# Altium schematic sheet Monitoring.SchDoc
size Letter; SheetNumber: 9; SheetTotal: 13
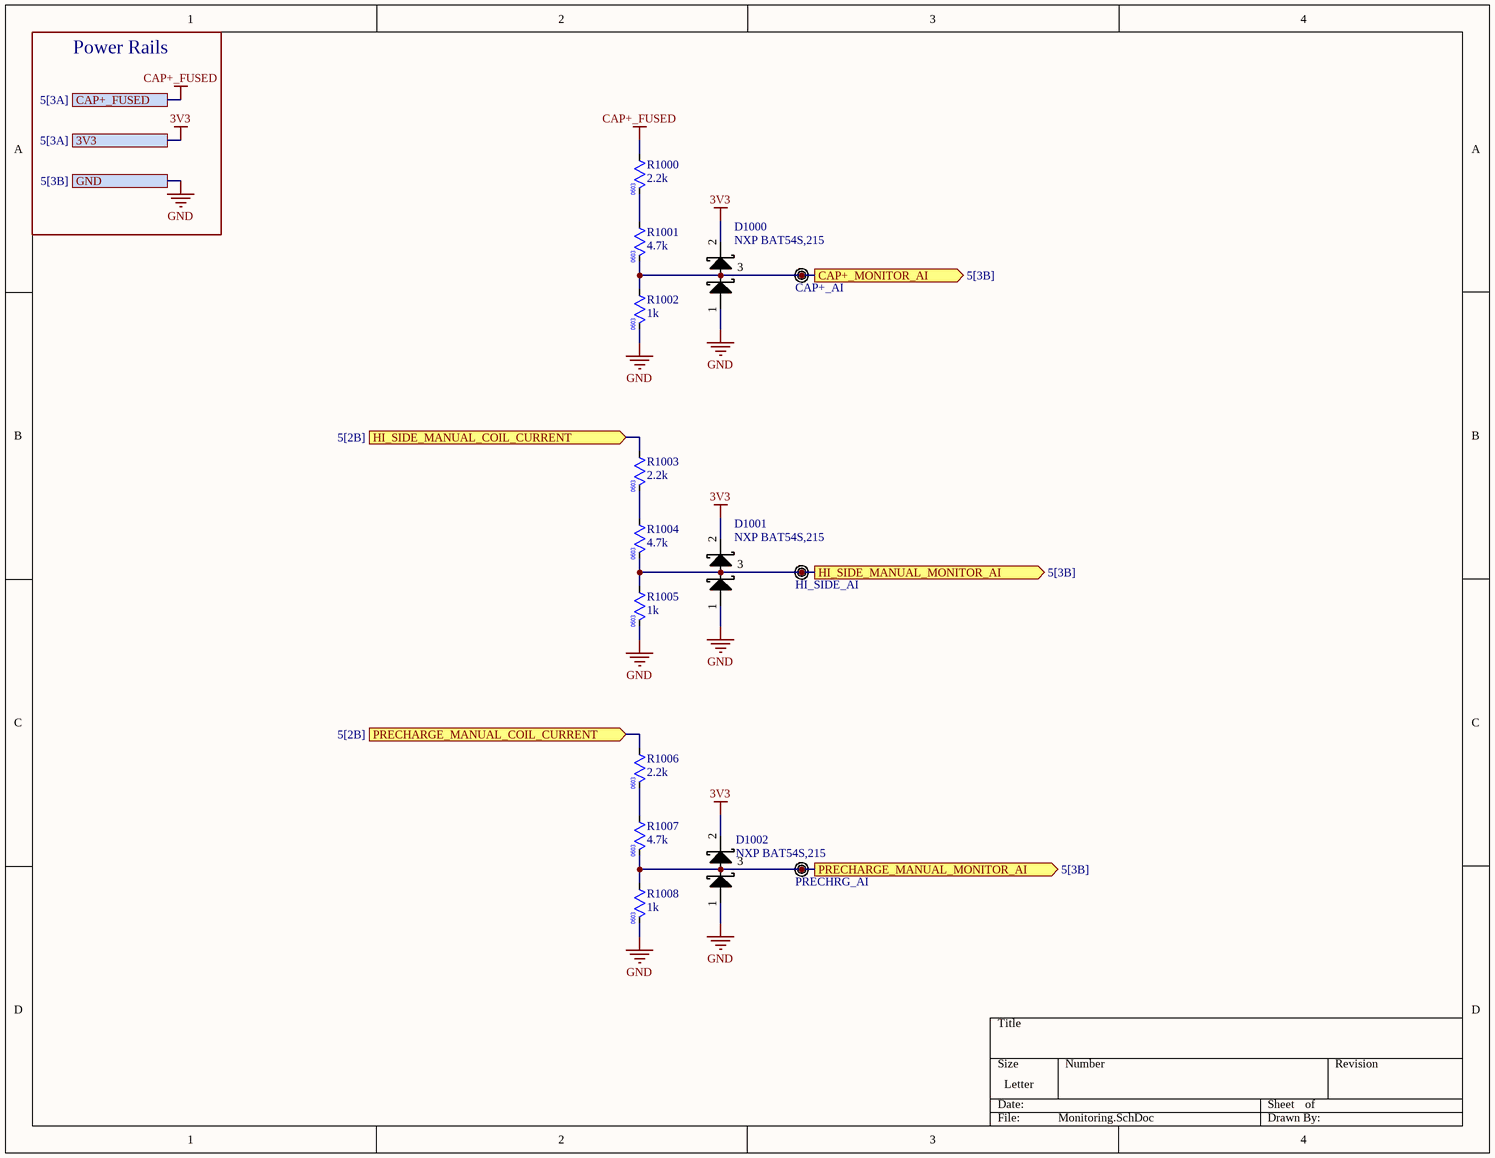
[diagram p0: Monitoring.SchDoc]

## Parts
D1000  NXP BAT54S,215  [NXP BAT54S,215]
D1001  NXP BAT54S,215  [NXP BAT54S,215]
D1002  NXP BAT54S,215  [NXP BAT54S,215]
R1000  value 2.2k  [0603 Resistor Footprint]  (hidden comment: 0603 2k2 1% 0.25W)
R1001  value 4.7k  [0603 Resistor Footprint]  (hidden comment: 0603 4k7 1% 0.33W)
R1002  value 1k  [0603 Resistor Footprint]  (hidden comment: 0603 1k 1% 0.33W)
R1003  value 2.2k  [0603 Resistor Footprint]  (hidden comment: 0603 2k2 1% 0.25W)
R1004  value 4.7k  [0603 Resistor Footprint]  (hidden comment: 0603 4k7 1% 0.33W)
R1005  value 1k  [0603 Resistor Footprint]  (hidden comment: 0603 1k 1% 0.33W)
R1006  value 2.2k  [0603 Resistor Footprint]  (hidden comment: 0603 2k2 1% 0.25W)
R1007  value 4.7k  [0603 Resistor Footprint]  (hidden comment: 0603 4k7 1% 0.33W)
R1008  value 1k  [0603 Resistor Footprint]  (hidden comment: 0603 1k 1% 0.33W)
TP1000  CAP+_AI  [TESTPOINT]  (no BOM)
TP1001  HI_SIDE_AI  [TESTPOINT]  (no BOM)
TP1002  PRECHRG_AI  [TESTPOINT]  (no BOM)

## Ports
3V3 (see 5[3A]), CAP+_FUSED (see 5[3A]), CAP+_MONITOR_AI (out, see 5[3B]), GND (see 5[3B]), HI_SIDE_MANUAL_COIL_CURRENT (in, see 5[2B]), HI_SIDE_MANUAL_MONITOR_AI (out, see 5[3B]), PRECHARGE_MANUAL_COIL_CURRENT (in, see 5[2B]), PRECHARGE_MANUAL_MONITOR_AI (out, see 5[3B])

## Nets
3V3: D1000.2 D1001.2 D1002.2 ; port 3V3
CAP+_FUSED: R1000.1 ; port CAP+_FUSED
GND: D1000.1 D1001.1 D1002.1 R1002.2 R1005.2 R1008.2 ; port GND
CAP+_MONITOR_AI: D1000.3 R1001.2 R1002.1 TP1000.1(TP) ; port CAP+_MONITOR_AI
HI_SIDE_MANUAL_COIL_CURRENT: R1003.1 ; port HI_SIDE_MANUAL_COIL_CURRENT
HI_SIDE_MANUAL_MONITOR_AI: D1001.3 R1004.2 R1005.1 TP1001.1(TP) ; port HI_SIDE_MANUAL_MONITOR_AI
PRECHARGE_MANUAL_COIL_CURRENT: R1006.1 ; port PRECHARGE_MANUAL_COIL_CURRENT
PRECHARGE_MANUAL_MONITOR_AI: D1002.3 R1007.2 R1008.1 TP1002.1(TP) ; port PRECHARGE_MANUAL_MONITOR_AI
NetR1000_2: R1000.2 R1001.1
NetR1003_2: R1003.2 R1004.1
NetR1006_2: R1006.2 R1007.1

## Notes on the sheet
- Power Rails
- (in symbol CMP-009-00190-8) 0603

## Library data of the parts
D1000-D1002 = CMP-011-0005-2: DIODE ARRAY SCHOTTKY 30V SOT23 / Diode Schottky 0.2A Automotive 3-Pin TO-236AB T/R; Forward Voltage: 800mV; Forward Current: 100mA; Case/Package: SOT-23; Mounting Technology: Surface Mount; Max Operating Temperature: 150°C; Min Operating Temperature: -55°C; Pins: 3; RoHS Compliant: Yes; Component Type: Standard; Design Item ID: NXP BAT54S,215
R1000 R1003 R1006 = CMP-009-00190-8: RES SMD 2.2K OHM 1% 1/4W 0603; Manufacturer Part Number: RCS06032K20FKEA; Digikey Part Number: 541-10449-1-ND
R1001 R1004 R1007 = CMP-009-00182-7: RES SMD 4.7K OHM 1% 1/3W 0603; Manufacturer Part Number: CRCW06034K70FKEAHP; Power: 250mW; Min Operating Temperature: -55°C; Pins: 2; Case/Package: 0603; Tolerance: 1%; Max Operating Temperature: 155°C; RoHS Compliant: Yes; Mounting Technology: Surface Mount; Digikey Part Number: 541-4.70KSCT-ND
R1002 R1005 R1008 = CMP-009-00184-7: RES SMD 1K OHM 1% 1/3W 0603; Manufacturer Part Number: CRCW06031K00FKEAHP; Power: 250mW; Max Operating Temperature: 155°C; RoHS Compliant: Yes; Pins: 2; Case/Package: 0603; Tolerance: 1%; Mounting Technology: Surface Mount; Min Operating Temperature: -55°C; Digikey Part Number: 541-1.00KSCT-ND
TP1000-TP1002 = CMP-020-0000-4: Source: UBC Formula Electric.SchLib; Design Item ID: Thru-Hole Test Point